# EAGLE design ir array final (EAGLE 8.5.1)
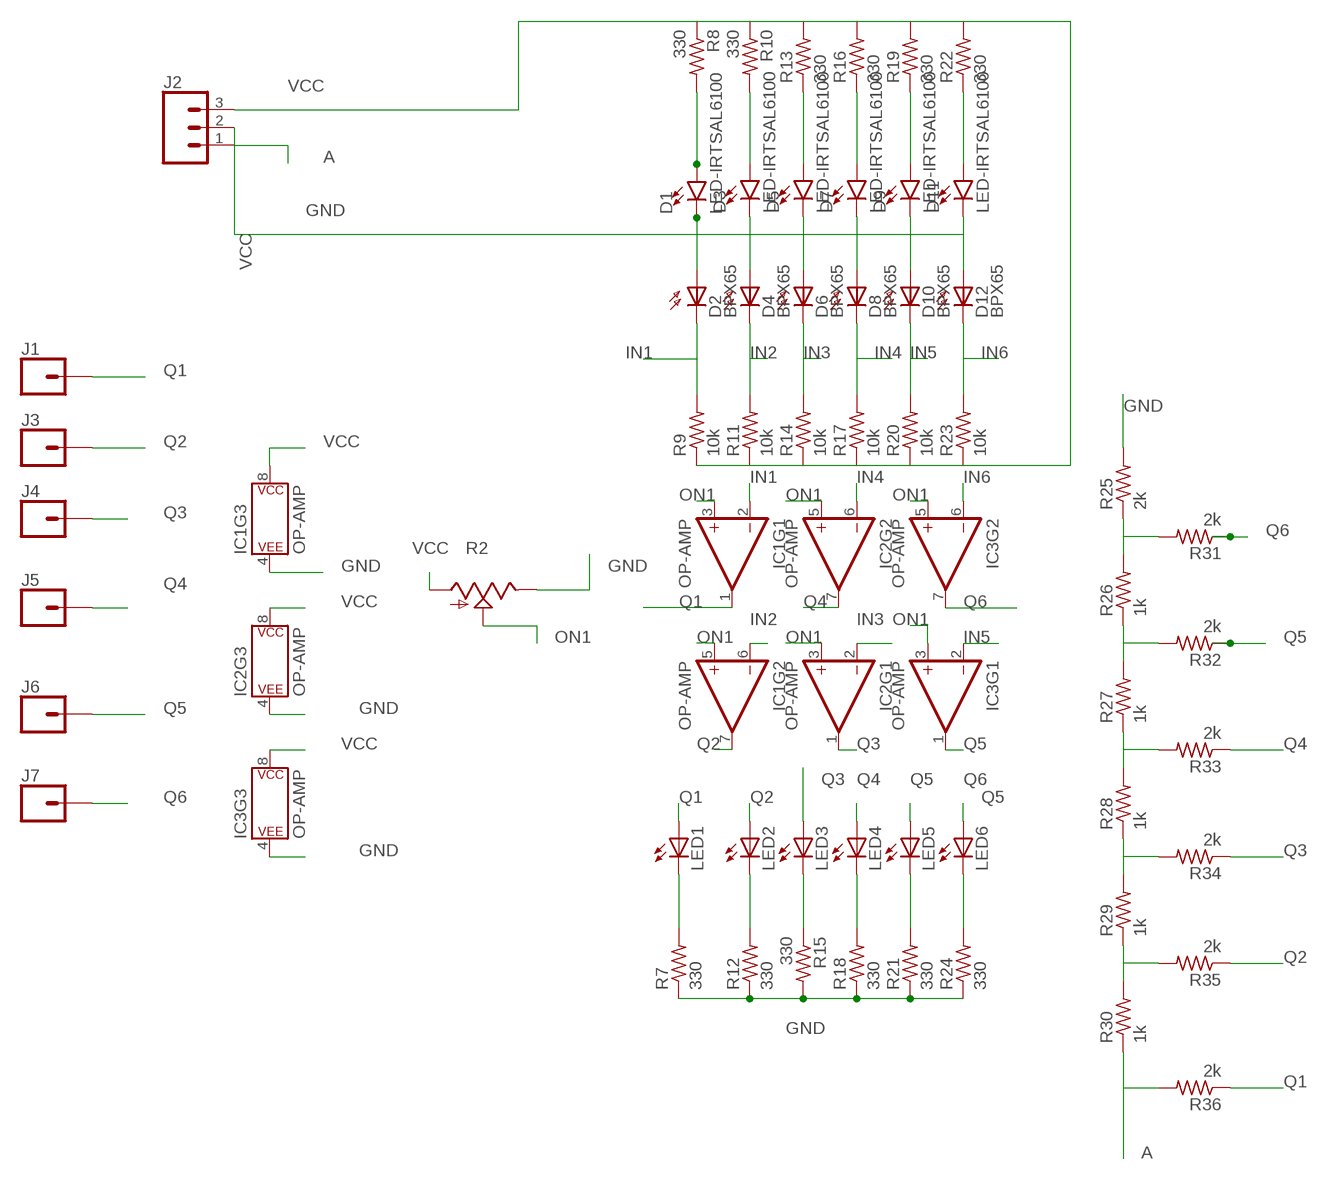
[diagram p0: schematic, sheet 1]

## Parts
D1  LED-IRTSAL6100  [LED_5MM]
D2  BPX65  [BPX65]
D3  LED-IRTSAL6100  [LED_5MM]
D4  BPX65  [BPX65]
D5  LED-IRTSAL6100  [LED_5MM]
D6  BPX65  [BPX65]
D7  LED-IRTSAL6100  [LED_5MM]
D8  BPX65  [BPX65]
D9  LED-IRTSAL6100  [LED_5MM]
D10  BPX65  [BPX65]
D11  LED-IRTSAL6100  [LED_5MM]
D12  BPX65  [BPX65]
IC1  OP-AMP  OPAMP-DUALDIP  [DIP08]
IC2  OP-AMP  OPAMP-DUALDIP  [DIP08]
IC3  OP-AMP  OPAMP-DUALDIP  [DIP08]
J1  CONN_01  [1X01]
J2  CONN_03  [1X03]
J3  CONN_01  [1X01]
J4  CONN_01  [1X01]
J5  CONN_01  [1X01]
J6  CONN_01  [1X01]
J7  CONN_01  [1X01]
LED1  LED3MM  [LED3MM]
LED2  LED3MM  [LED3MM]
LED3  LED3MM  [LED3MM]
LED4  LED3MM  [LED3MM]
LED5  LED3MM  [LED3MM]
LED6  LED3MM  [LED3MM]
R2  TRIM_US-CA6V  [CA6V]
R7  330  R-US_0207/9  [0207/9]
R8  330  R-US_0207/9  [0207/9]
R9  10k  R-US_0207/9  [0207/9]
R10  330  R-US_0207/9  [0207/9]
R11  10k  R-US_0207/9  [0207/9]
R12  330  R-US_0207/9  [0207/9]
R13  330  R-US_0207/9  [0207/9]
R14  10k  R-US_0207/9  [0207/9]
R15  330  R-US_0207/9  [0207/9]
R16  330  R-US_0207/9  [0207/9]
R17  10k  R-US_0207/9  [0207/9]
R18  330  R-US_0207/9  [0207/9]
R19  330  R-US_0207/9  [0207/9]
R20  10k  R-US_0207/9  [0207/9]
R21  330  R-US_0207/9  [0207/9]
R22  330  R-US_0207/9  [0207/9]
R23  10k  R-US_0207/9  [0207/9]
R24  330  R-US_0207/9  [0207/9]
R25  2k  R-US_0207/9  [0207/9]
R26  1k  R-US_0207/9  [0207/9]
R27  1k  R-US_0207/9  [0207/9]
R28  1k  R-US_0207/9  [0207/9]
R29  1k  R-US_0207/9  [0207/9]
R30  1k  R-US_0207/9  [0207/9]
R31  2k  R-US_0207/9  [0207/9]
R32  2k  R-US_0207/9  [0207/9]
R33  2k  R-US_0207/9  [0207/9]
R34  2k  R-US_0207/9  [0207/9]
R35  2k  R-US_0207/9  [0207/9]
R36  2k  R-US_0207/9  [0207/9]

## Nets
A: J2.1 R30.1 R36.2
GND: D1.K(C) D2.A D3.K(C) D4.A D5.K(C) D6.A D7.K(C) D8.A D9.K(C) D10.A D11.K(C) D12.A IC1.4(P$V-) IC2.4(P$V-) IC3.4(P$V-) J2.2 R2.E R7.1 R12.1 R15.2 R18.1 R21.1 R24.1 R25.2
IN1 [available]: D2.K(C) IC1.2(-IN) R9.2
IN2: D4.K(C) IC1.6(-IN) R11.2
IN3: D6.K(C) IC2.2(-IN) R14.2
IN4: D8.K(C) IC2.6(-IN) R17.2
IN5: D10.K(C) IC3.2(-IN) R20.2
IN6: D12.K(C) IC3.6(-IN) R23.2
N$8: D1.A R8.2
N$9: D3.A R10.2
N$10: D5.A R13.1
N$11: D7.A R16.1
N$12: D9.A R19.1
N$13: D11.A R22.1
N$19: LED1.K(C) R7.2
N$20: LED2.K(C) R12.2
N$21: LED3.K(C) R15.1
N$22: LED4.K(C) R18.2
N$23: LED5.K(C) R21.2
N$24: LED6.K(C) R24.2
N$25: R25.1 R26.2 R31.2
N$26: R26.1 R27.2 R32.2
N$27: R27.1 R28.2 R33.2
N$28: R28.1 R29.2 R34.2
N$29: R29.1 R30.2 R35.2
ON1: IC1.3(+IN) IC1.5(+IN) IC2.3(+IN) IC2.5(+IN) IC3.3(+IN) IC3.5(+IN) R2.S
Q1: IC1.1(OUT) J1.1 LED1.A R36.1
Q2: IC1.7(OUT) J3.1 LED2.A R35.1
Q3: IC2.1(OUT) J4.1 LED3.A R34.1
Q4: IC2.7(OUT) J5.1 LED4.A R33.1
Q5: IC3.1(OUT) J6.1 LED5.A R32.1
Q6: IC3.7(OUT) J7.1 LED6.A R31.1
VCC [available]: IC1.8(P$V+) IC2.8(P$V+) IC3.8(P$V+) J2.3 R2.A R8.1 R9.1 R10.1 R11.1 R13.2 R14.1 R16.2 R17.1 R19.2 R20.1 R22.2 R23.1

## Library data of the parts
D1 D3 D5 D7 D9 D11 = SparkFun-LED:LED-IR: Infrared LED (IR) Wavelength: 940nm Packages: TSAL6100 LTE302 - Side firing. Check SparkFun-Sensors.lbr for the receiver SparkFun Products: ZX Distance and Gesture Sensor <[https://www.sparkfun.com/products/12780]> Infrared Emitters and Detectors <https://www.sparkfun.com/products/241>; PROD_ID: DIO-12058
D2 D4 D6 D8 D10 D12 = opto-trans-siemens:BPX65: PHOTO DIODE; MPN: BPX65.; OC_FARNELL: 327451; OC_NEWARK: 06WX2764
IC1-IC3 = SparkFun-IC-Amplifiers:OPAMP-DUAL: Generic op-amp footprint This component is for the standard 358 pinning of a dual op-amp From the LM358 datasheet: Pin 1: Output A Pin 2: Inverting Input A Pin 3: Non-Inverting Input A Pin 4: Gnd Pin 5: Non-Inverting Input B Pin 6: Inverting Input B Pin 7: Output B Pin 8: V+; PROD_ID: NA-XXXXX
J1 J3-J7 = SparkFun-Connectors:CONN_01: Single connection point. Often used as Generic Header-pin footprint for 0.1 inch spaced/style header connections On any of the 0.1 inch spaced packages, you can populate with these: Break Away Headers - Straight <https://www.sparkfun.com/products/116> (PRT-00116) Break Away Male Headers - Right Angle <https://www.sparkfun.com/products/553> (PRT-00553) Female Headers <https://www.sparkfun.com/products/115> (PRT-00115) Break Away Headers - Machine Pin <https://www.sparkfun.com/products/117> (PRT-00117) Break Away Female Headers - Swiss Machine Pin <https://www.sparkfun.com/products/743> (PRT-00743) This device is also useful as a general connection point to wire up your design to another part of your project. Our various solder wires solder well into these plated through hole pads. Hook-Up Wire - Assortment (Stranded, 22 AWG) <https://www.sparkfun.com/products/11375> (PRT-11375) Hook-Up Wire - Assortment (Solid Core, 22 AWG) <https://www.sparkfun.com/products/11367> (PRT-11367) View the entire wire category on our website here <https://www.sparkfun.com/categories/141> Special notes: SMTSO-256-ET is a "flush mount" nut for a 4-40 screw. We mostly use this on specialty testbeds; it is a nice way to connect hardware to your PCB at an adjustable hieght. Also note, the SNAP packages are for using a snappable style connector. We sell a baggie of snaps and they are also used on two LilyPad designs: Snap Assortment - 30 pack (male and female) <https://www.sparkfun.com/products/11347> (DEV-11347) LilyPad Arduino SimpleSnap <https://www.sparkfun.com/products/10941> (DEV-10941) LilyPad SimpleSnap Protoboard <https://www.sparkfun.com/products/10940> (DEV-10940)
J2 = SparkFun-Connectors:CONN_03: Multi connection point. Often used as Generic Header-pin footprint for 0.1 inch spaced/style header connections On any of the 0.1 inch spaced packages, you can populate with these: Break Away Headers - Straight <https://www.sparkfun.com/products/116> (PRT-00116) Break Away Male Headers - Right Angle <https://www.sparkfun.com/products/553> (PRT-00553) Female Headers <https://www.sparkfun.com/products/115> (PRT-00115) Break Away Headers - Machine Pin <https://www.sparkfun.com/products/117> (PRT-00117) Break Away Female Headers - Swiss Machine Pin <https://www.sparkfun.com/products/743> (PRT-00743) Stackable Header - 3 Pin (Female, 0.1") <https://www.sparkfun.com/products/13875> (PRT-13875) For SCREWTERMINALS and SPRING TERMINALS visit here: Screw Terimnals on SparkFun.com <https://www.sparkfun.com/search/results?term=Screw+Terminals> (5mm/3.5mm/2.54mm spacing) This device is also useful as a general connection point to wire up your design to another part of your project. Our various solder wires solder well into these plated through hole pads. Hook-Up Wire - Assortment (Stranded, 22 AWG) <https://www.sparkfun.com/products/11375> (PRT-11375) Hook-Up Wire - Assortment (Solid Core, 22 AWG) <https://www.sparkfun.com/products/11367> (PRT-11367) View the entire wire category on our website here <https://www.sparkfun.com/categories/141> Special notes: Molex polarized connector foot print use with SKU : PRT-08232 with associated crimp pins and housings.
LED1-LED6 = adafruit:LED: LED OSRAM: - CHIPLED LG R971, LG N971, LY N971, LG Q971, LY Q971, LO R971, LY R971 LH N974, LH R974 LS Q976, LO Q976, LY Q976 LO Q996 - Hyper CHIPLED LW Q18S LB Q993, LB Q99A, LB R99A - SideLED LS A670, LO A670, LY A670, LG A670, LP A670 LB A673, LV A673, LT A673, LW A673 LH A674 LY A675 LS A676, LA A676, LO A676, LY A676, LW A676 LS A679, LY A679, LG A679 - Hyper Micro SIDELED® LS Y876, LA Y876, LO Y876, LY Y876 LT Y87S - SmartLED LW L88C, LW L88S LB L89C, LB L89S, LG L890 LS L89K, LO L89K, LY L89K LS L896, LA L896, LO L896, LY L896 - TOPLED LS T670, LO T670, LY T670, LG T670, LP T670 LSG T670, LSP T670, LSY T670, LOP T670, LYG T670 LG T671, LOG T671, LSG T671 LB T673, LV T673, LT T673, LW T673 LH T674 LS T676, LA T676, LO T676, LY T676, LB T676, LH T676, LSB T676, LW T676 LB T67C, LV T67C, LT T67C, LS T67K, LO T67K, LY T67K, LW E67C LS E67B, LA E67B, LO E67B, LY E67B, LB E67C, LV E67C, LT E67C LW T67C LS T679, LY T679, LG T679 LS T770, LO T770, LY T770, LG T770, LP T770 LB T773, LV T773, LT T773, LW T773 LH T774 LS E675, LA E675, LY E675, LS T675 LS T776, LA T776, LO T776, LY T776, LB T776 LHGB T686 LT T68C, LB T68C - Hyper Mini TOPLED® LB M676 - Mini TOPLED Santana® LG M470 LS M47K, LO M47K, LY M47K Source: http://www.osram.convergy.de/
R2 = pot:TRIM_US-: POTENTIOMETER
R7-R36 = adafruit:R-US_: RESISTOR, American symbol

## Net classes
0 default: width 1 mm, drill 1 mm, clearance 0.8 mm
1 available: width 1 mm, drill 1 mm, clearance 0.8 mm
2 power: width 2 mm, drill 1 mm, clearance 1 mm

## Board
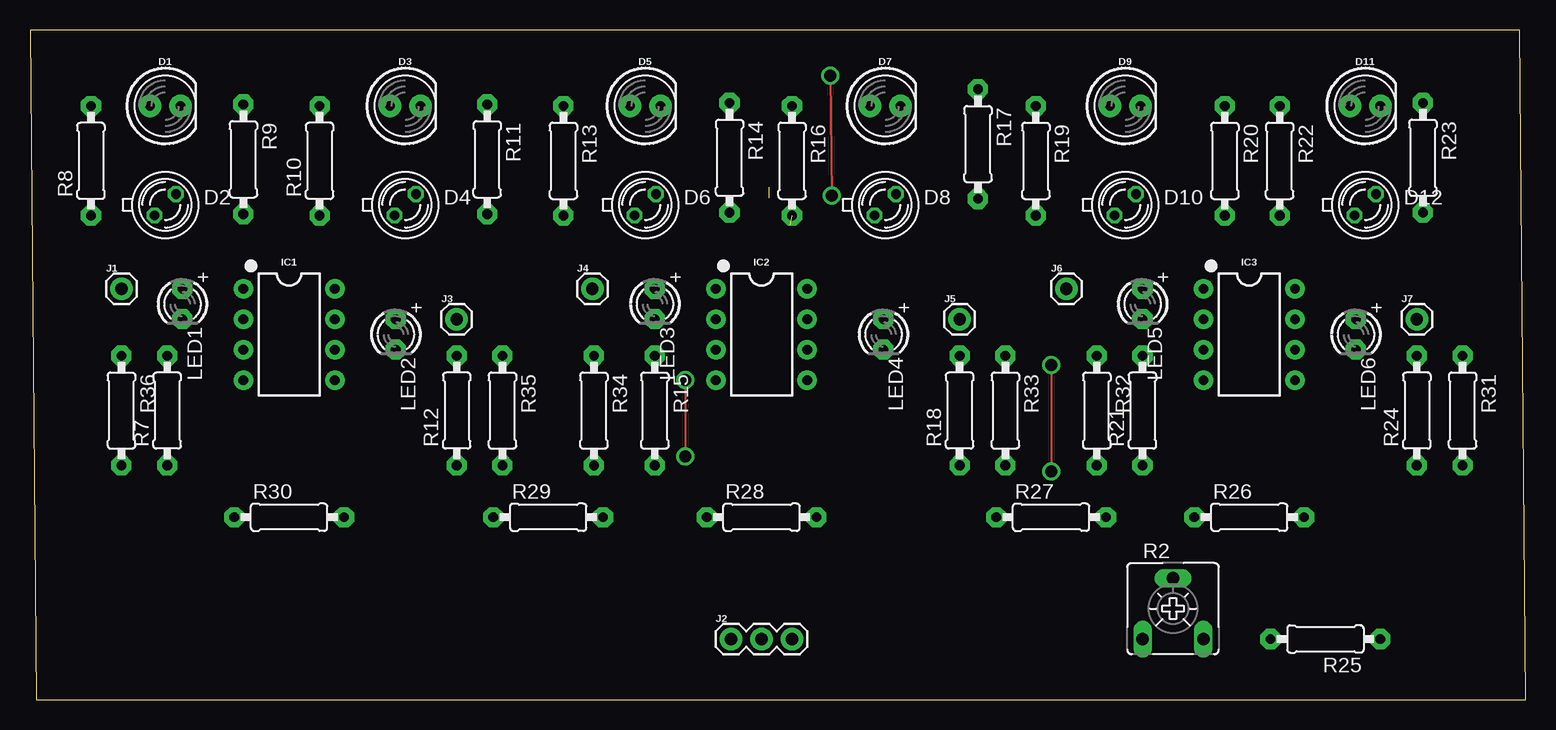
[diagram p1: board, top side]
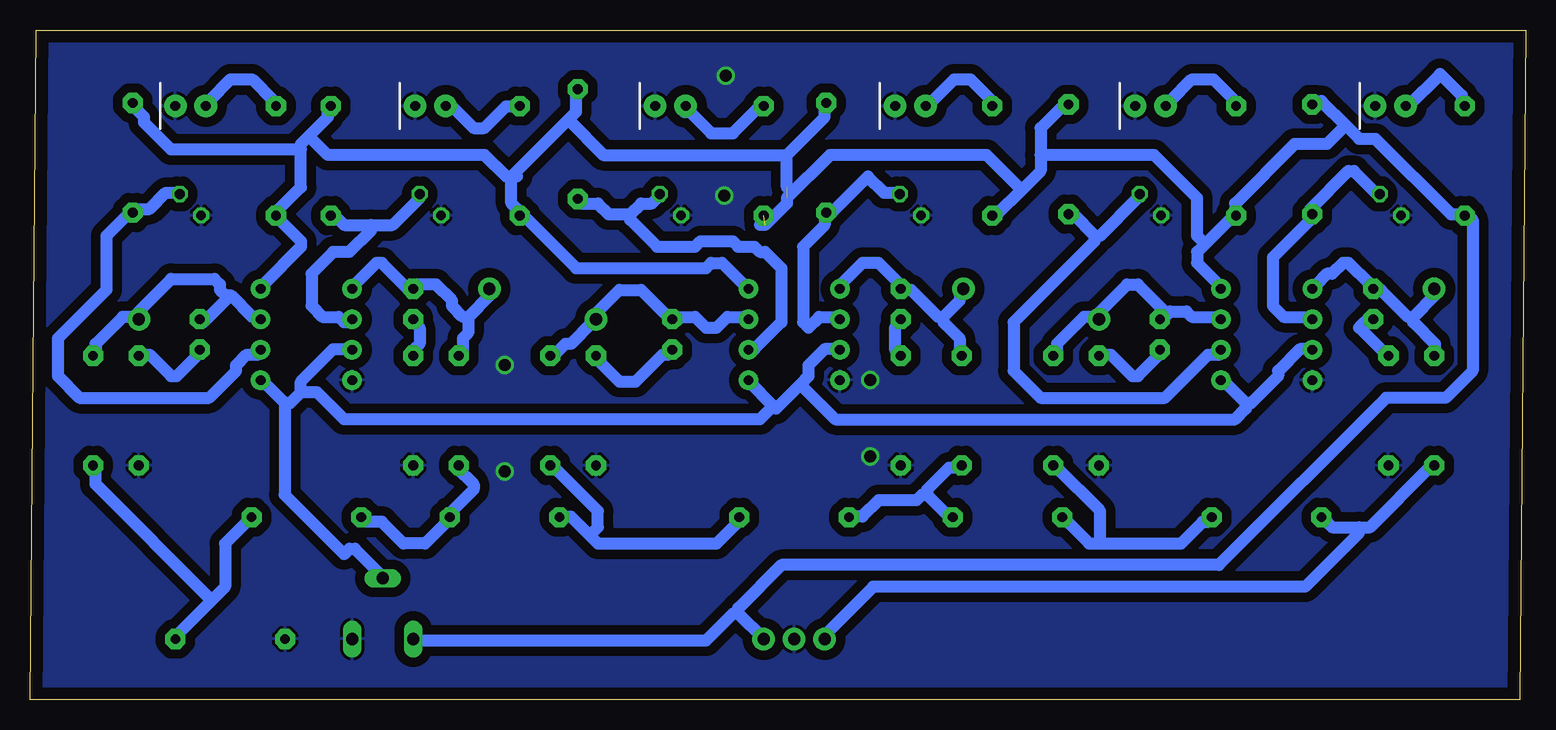
[diagram p2: board, bottom side, seen from below]

Size 124.64 x 55.87 mm. Coordinates in mm from the lower left corner, seen from the top.
Outline: 0.51,0 124.64,0 124.13,55.87 0,55.87 0.51,0
Copper layers (1*16): Top 0.035mm / dielectric 1.5mm / Bottom 0.035mm
Design rules "default": minimum track width 6mil, minimum drill 0.35mm, track to track 6mil, track to pad 6mil, pad to pad 6mil, via to via 6mil, smd to smd 6mil, copper to edge 40mil, drill to drill 6mil, minimum pad ring 10mil, minimum via ring 8mil, stop-mask expansion 4mil, vias tented up to drill 0mil, thermal gap 10mil

### Footprints (pad centres in the part's own frame; a part is rotated, then mirrored left to right if it is on the bottom)
LED_5MM = drill 0.813 pad 1.88: A -1.27,0; K 1.27,0
BPX65 = drill 0.813 octagon: A -0.889,-0.889; K 0.889,0.889
DIP08 = drill 0.813 pad 1.626: 1 -3.81,-3.81; 2 -1.27,-3.81; 3 1.27,-3.81; 4 3.81,-3.81; 5 3.81,3.81; 6 1.27,3.81; 7 -1.27,3.81; 8 -3.81,3.81
1X01 = drill 1.016 pad 1.88: 1 0,0
1X03 = drill 1.016 pad 1.88: 1 0,0; 2 2.54,0; 3 5.08,0
LED3MM = drill 0.813 pad 1.676 octagon: A -1.27,0; K 1.27,0
CA6V = drill 1.016 long: A -2.54,-2.54; E 2.54,-2.54; S 0,2.54
0207/9 = drill 0.813 pad 1.676 octagon: 1 -4.572,0; 2 4.572,0

### Placement (x,y rotation side)
D1  11.27,49.53 0 top
D2  11.27,41.3 0 top
D3  31.27,49.53 0 top
D4  31.27,41.3 0 top
D5  51.27,49.53 0 top
D6  51.27,41.3 0 top
D7  71.27,49.53 0 top
D8  71.27,41.3 0 top
D9  91.27,49.53 0 top
D10  91.27,41.3 0 top
D11  111.26,49.53 0 top
D12  111.27,41.3 0 top
IC1  21.59,30.48 270 top
IC2  60.96,30.48 270 top
IC3  101.6,30.48 270 top
J1  7.62,34.29 0 top
J2  58.42,5.08 0 top
J3  35.56,31.75 0 top
J4  46.86,34.29 0 top
J5  77.47,31.75 0 top
J6  86.36,34.29 0 top
J7  115.57,31.75 0 top
LED1  12.7,33.02 270 top
LED2  30.48,30.48 270 top
LED3  52.07,33.02 270 top
LED4  71.12,30.48 270 top
LED5  92.71,33.02 270 top
LED6  110.49,30.48 270 top
R2  95.25,7.62 0 top
R7  11.43,24.13 90 top
R8  5.08,44.96 90 top
R9  17.78,45.09 270 top
R10  24.13,44.96 90 top
R11  38.1,45.09 270 top
R12  35.56,24.13 90 top
R13  44.45,44.96 270 top
R14  58.29,45.21 270 top
R15  52.07,24.13 270 top
R16  63.5,44.96 270 top
R17  78.99,46.35 270 top
R18  77.47,24.13 90 top
R19  83.82,44.96 270 top
R20  99.57,44.96 270 top
R21  92.71,24.13 90 top
R22  104.14,44.96 270 top
R23  116.08,45.21 270 top
R24  115.57,24.13 90 top
R25  107.95,5.08 180 top
R26  101.6,15.24 0 top
R27  85.09,15.24 0 top
R28  60.96,15.24 0 top
R29  43.18,15.24 0 top
R30  21.59,15.24 0 top
R31  119.38,24.13 270 top
R32  88.9,24.13 270 top
R33  81.28,24.13 270 top
R34  46.99,24.13 270 top
R35  39.37,24.13 270 top
R36  7.62,24.13 270 top

### Tracks (layer width: path | path; a pad name or v marks a point on that pad's centre or on a via)
A
  Bottom 1: 13.87,14.4 16.12,14.4 16.57,14.85 R30.1 | 13.87,14.4 12.97,14.4 8.02,19.35 R36.2 | J2.1 58.42,5.4 54.37,9.45 18.37,9.45 13.87,13.95 13.87,14.4
GND  (via drill 1 pad 1.3)
  Top 0.152: v85.09,27.94 v85.09,19.05 | v54.61,26.67 v54.61,20.32 | v66.67,52.07 v66.8,42.04
  pour Bottom: 0,57.15 0,0 124.46,0 124.46,57.15
IN1
  Bottom 1: D2.K 12.52,42.3 14.32,44.1 14.77,44.1 17.92,40.95 R9.2 17.92,40.05 21.07,36.9 21.07,32.85 20.17,31.95 17.92,31.95 IC1.2
IN2
  Bottom 1: 35.92,38.7 35.47,38.7 32.32,41.85 D4.K | 35.92,38.7 37.72,40.5 R11.2 | IC1.6 25.57,28.8 26.47,28.8 30.07,25.2 40.42,25.2 42.67,27.45 42.67,31.5 35.92,38.25 35.92,38.7
IN3
  Bottom 1: D6.K 52.57,42.3 53.47,42.3 54.82,43.65 57.97,40.5 R14.2 58.42,40.5 58.42,39.6 60.22,37.8 60.22,31.5 59.77,31.05 58.87,31.95 57.52,31.95 IC2.2
IN4
  Bottom 1: 74.62,40.5 73.72,41.4 72.82,41.4 72.37,41.85 D8.K | 74.62,40.5 76.42,40.5 77.32,41.4 78.67,41.4 R17.2 | IC2.6 64.72,29.25 64.27,29.25 62.02,31.5 62.02,36 63.37,37.35 63.82,37.35 64.27,37.8 65.62,37.8 66.07,38.25 68.77,38.25 69.22,37.8 72.37,37.8 74.62,40.05 74.62,40.5
IN5
  Bottom 1: 96.22,39.6 98.47,39.6 99.37,40.5 R20.2 | 96.22,39.6 94.42,39.6 92.17,41.85 D10.K | IC3.2 98.02,31.5 98.47,31.5 98.92,31.95 100.27,31.95 101.17,32.85 101.17,35.55 99.37,37.35 98.02,37.35 96.22,39.15 96.22,39.6
IN6
  Bottom 1: D12.K 112.42,42.3 113.32,42.3 114.67,40.95 116.02,40.95 R23.2 116.47,40.5 118.27,38.7 118.27,34.2 122.32,30.15 122.32,27 120.52,25.2 109.72,25.2 107.47,27.45 107.47,27.9 106.57,28.8 105.67,28.8 IC3.6
N$8
  Bottom 1: R8.2 5.32,49.95 5.32,50.4 7.12,52.2 9.82,49.5 D1.A
N$9
  Bottom 1: R10.2 24.22,49.95 26.02,51.75 27.82,51.75 29.62,49.95 D3.A
N$10
  Bottom 1: R13.1 44.47,49.95 46.27,51.75 47.62,51.75 49.87,49.5 D5.A
N$11
  Bottom 1: R16.1 63.82,49.5 66.07,47.25 67.87,47.25 69.67,49.05 70.12,49.05 70.12,49.5 D7.A
N$12
  Bottom 1: R19.1 84.07,49.5 84.97,49.5 86.77,47.7 87.67,47.7 89.92,49.95 D9.A
N$13
  Bottom 1: R22.1 104.32,49.95 106.12,51.75 107.92,51.75 109.72,49.95 D11.A
N$19
  Bottom 1: R7.2 11.62,28.8 13.87,31.05 12.97,31.95 LED1.K
N$20
  Bottom 1: LED2.K 30.52,28.8 32.32,27 32.77,27 34.57,28.8 35.47,28.8 R12.2
N$21
  Bottom 1: R15.1 52.12,28.8 52.57,29.25 52.57,31.05 52.12,31.5 LED3.K
N$22
  Bottom 1: LED4.K 71.47,28.8 71.92,28.8 74.17,26.55 75.52,26.55 77.32,28.35 R18.2
N$23
  Bottom 1: R21.2 92.62,28.8 92.62,29.25 92.17,29.7 92.17,31.05 92.62,31.5 LED5.K
N$24
  Bottom 1: LED6.K 110.62,28.8 112.42,27 112.87,27 114.67,28.8 115.57,28.8 R24.2
N$25
  Bottom 1: 109.49,8.32 108.37,9.45 108.37,13.05 106.57,14.85 R26.2 | 109.49,8.32 112.42,5.4 R25.1 | 109.49,8.32 119.17,18 119.17,19.35 R31.2
N$26
  Bottom 1: R32.2 89.02,19.35 87.67,18 87.67,17.55 89.47,15.75 89.47,15.3 R27.2 89.92,14.85 91.72,13.05 93.52,13.05 95.32,14.85 96.67,14.85 R26.1
N$27
  Bottom 1: 77.99,13.72 79.57,15.3 80.47,15.3 R27.1 | 77.99,13.72 77.32,13.05 67.42,13.05 65.62,14.85 R28.2 | 77.99,13.72 77.32,14.4 77.32,15.75 80.92,19.35 R33.2
N$28
  Bottom 1: 49.87,17.1 48.07,15.3 R29.2 | 49.87,17.1 49.87,17.55 48.07,19.35 47.17,19.35 R34.2 | R28.1 56.17,15.3 55.27,15.3 53.92,16.65 50.77,16.65 50.32,17.1 49.87,17.1
N$29
  Bottom 1: 35.47,13.05 36.37,13.05 38.17,14.85 R29.1 | 35.47,13.05 28.72,13.05 26.92,14.85 26.47,14.85 R30.2 | 35.47,13.05 35.47,15.75 39.07,19.35 R35.2
ON1
  Bottom 1: 103.42,24.75 103.42,17.1 98.47,12.15 98.02,12.6 97.57,12.6 95.32,10.35 R2.S | 103.42,24.75 105.22,26.55 IC3.5 | 102.07,25.65 102.07,26.55 99.37,29.25 98.02,29.25 IC3.3 | 102.07,25.65 102.97,24.75 103.42,24.75 | 23.32,24.75 25.12,26.55 IC1.5 | 23.32,24.75 22.87,24.75 20.62,27 20.62,27.45 18.82,29.25 17.92,29.25 IC1.3 | 62.7,24.52 62.47,24.3 60.45,26.32 | 62.7,24.52 64.72,26.55 IC2.5 | 60.45,26.32 59.77,27 59.77,27.9 58.42,29.25 57.52,29.25 IC2.3 | 60.45,26.32 57.52,23.4 24.22,23.4 23.32,24.3 23.32,24.75 | 102.07,25.65 100.72,25.65 98.47,23.4 63.82,23.4 62.7,24.52
Q1
  Bottom 1: IC1.1 17.47,34.65 16.57,35.55 16.12,35.55 15.22,36.45 14.77,36.45 12.97,34.65 LED1.A 12.52,34.2 12.07,34.2 9.82,31.95 9.37,31.95 | 9.37,31.95 9.37,31.5 7.57,29.7 7.57,28.8 R36.1 | 9.37,31.95 7.57,33.75 7.57,34.2 J1.1
Q2
  Bottom 1: IC1.7 25.57,31.95 27.82,31.95 28.27,32.4 29.62,32.4 30.07,31.95 LED2.A 30.07,32.4 32.32,34.65 33.22,34.65 35.92,31.95 | 35.92,31.95 36.82,31.95 39.07,29.7 39.07,28.8 R35.1 | 35.92,31.95 J3.1
Q3
  Bottom 1: IC2.1 57.07,34.65 55.27,36.45 53.92,36.45 52.12,34.65 LED3.A 51.67,34.2 51.22,34.2 48.97,31.95 48.52,31.95 | 48.52,31.95 48.52,31.5 47.17,30.15 47.17,28.8 R34.1 | 48.52,31.95 47.17,33.3 47.17,34.2 J4.1
Q4
  Bottom 1: IC2.7 65.17,31.95 66.52,31.95 67.42,31.05 68.32,31.05 69.22,31.95 71.02,31.95 LED4.A 71.47,31.95 73.72,34.2 75.52,34.2 77.77,31.95 J5.1 77.77,31.5 79.57,29.7 80.02,29.7 80.92,28.8 R33.1
Q5
  Bottom 1: IC3.1 97.57,34.65 95.77,36.45 95.32,36.45 93.07,34.2 LED5.A 92.62,34.65 90.82,34.65 89.47,33.3 89.47,32.85 88.57,31.95 88.12,31.95 | 88.12,31.95 88.12,30.6 88.57,30.15 88.57,28.8 R32.1 | 88.12,31.95 86.32,33.75 86.32,34.2 J6.1
Q6
  Bottom 1: 107.92,33.75 106.12,31.95 105.67,31.95 IC3.7 | 107.92,33.75 110.17,31.5 LED6.A | R31.1 119.17,28.8 119.17,29.7 116.92,31.95 115.57,31.95 J7.1 115.57,32.4 112.87,35.1 109.27,35.1 108.82,34.65 108.82,34.2 108.37,33.75 107.92,33.75
VCC  (2 unrouted)
  Bottom 1: IC3.8 105.22,34.65 102.07,37.8 102.07,38.25 103.87,40.05 R22.2 104.32,40.5 102.07,42.75 102.07,45.9 | 101.39,47.02 102.07,46.35 102.07,45.9 | 101.39,47.02 99.82,48.6 99.82,49.5 R20.1 | 102.07,45.9 112.87,45.9 115.12,48.15 115.12,48.6 116.02,49.5 R23.1 | 61.57,45.45 58.42,48.6 58.42,49.5 R14.1 | 61.57,42.75 61.57,45.45 | 63.82,40.5 R16.2 | 83.62,40.5 79.12,36 68.32,36 67.87,36.45 66.97,36.45 65.17,34.65 IC2.8 | 84.52,43.65 84.3,43.88 | 84.3,43.88 79.8,48.38 | 79.8,48.38 79.12,49.05 79.12,50.85 R17.1 | 84.52,43.65 84.52,41.4 83.62,40.5 | 83.62,40.5 R19.2 | 61.57,45.45 76.87,45.45 79.8,48.38 | 101.39,47.02 99.82,45.45 86.77,45.45 84.97,43.65 84.52,43.65 | 65.62,7.2 66.07,7.2 68.32,4.95 92.62,4.95 R2.A | J2.3 65.62,7.2 | 42,42.52 40.42,44.1 40.42,45.45 | 42,42.52 44.02,40.5 R13.2 | 40.42,45.45 40.42,47.7 38.17,49.95 R11.1 | 26.7,38.02 24.22,40.5 R10.1 24.22,40.95 24.22,41.4 19.27,46.35 16.57,46.35 14.99,47.92 | 26.7,38.02 27.37,37.35 27.37,36.45 25.57,34.65 IC1.8 | 14.99,47.92 17.02,49.95 17.47,49.95 R9.1 | 14.99,47.92 13.87,46.8 12.52,46.8 6.22,40.5 5.32,40.5 R8.1 4.87,40.5 4.42,40.05 4.42,27.45 6.67,25.2 11.62,25.2 25.57,11.25 62.02,11.25 65.62,7.65 65.62,7.2 | 40.42,45.45 30.97,45.45 27.37,41.85 27.37,38.7 26.7,38.02 | 63.82,39.6 63.37,39.6 61.57,41.4 61.57,41.85 57.97,45.45 44.92,45.45 42,42.52 | 84.07,43.65 84.3,43.88